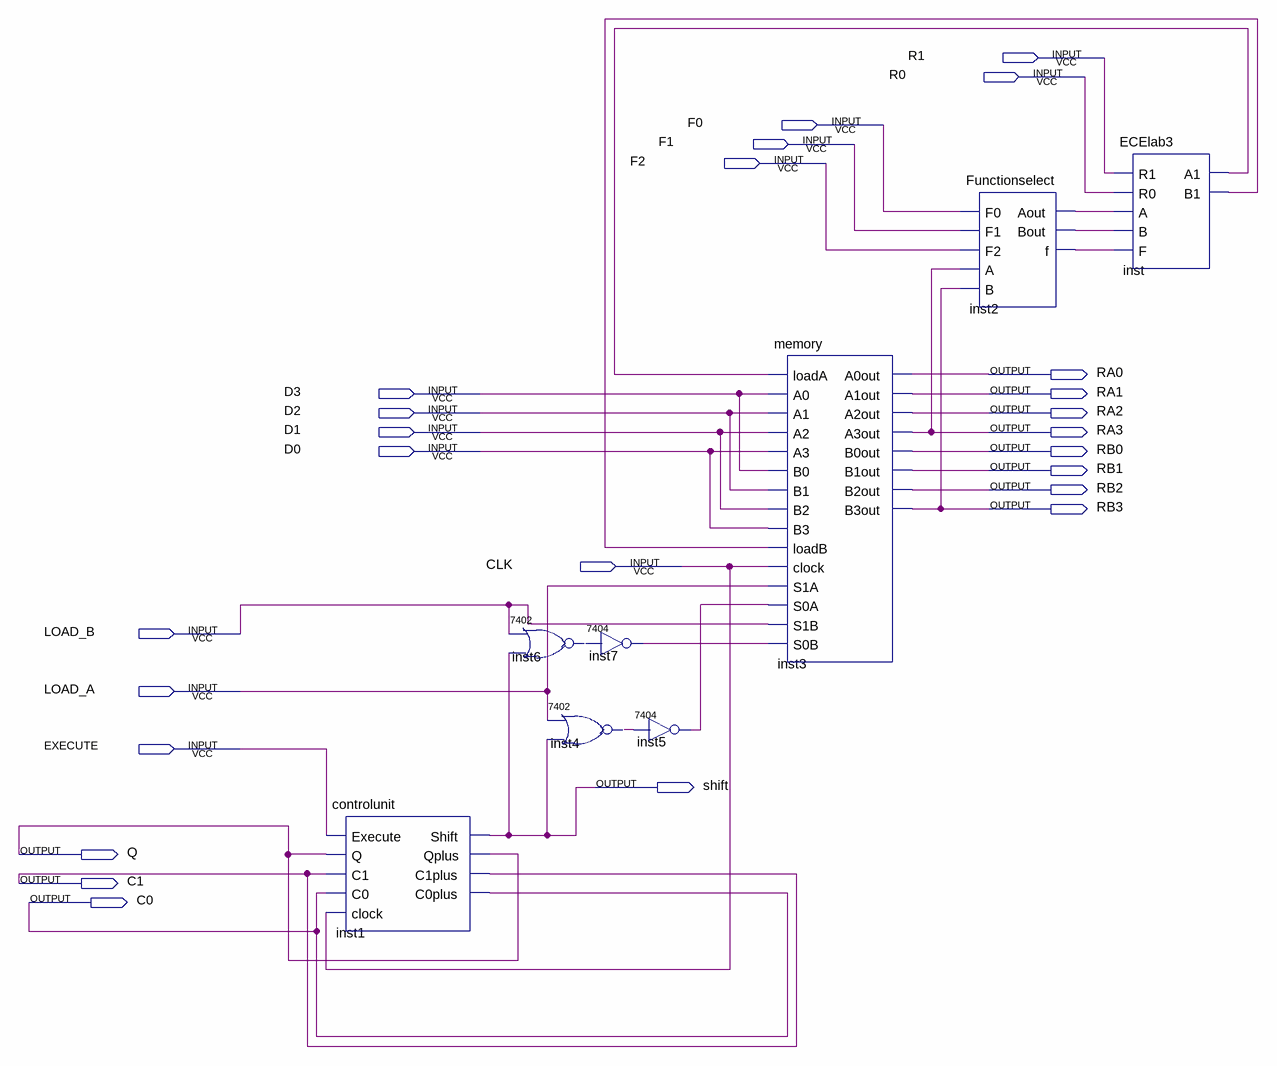
[diagram p0: schematic sheet]
// Quartus schematic lab3final.bdf as structural Verilog: 8 symbols, 25 pins
module lab3final (
  input  R1,
  input  R0,
  input  F0,
  input  F1,
  input  F2,
  input  D3,
  input  D2,
  input  D1,
  input  D0,
  input  CLK,
  input  LOAD_B,
  input  LOAD_A,
  input  EXECUTE,
  output RA0,
  output RA1,
  output RA2,
  output RA3,
  output RB0,
  output RB1,
  output RB2,
  output RB3,
  output shift,
  output Q,
  output C1,
  output C0
);

  wire inst2_aout, inst2_bout, inst2_f, inst4_1, inst5_1, inst6_1, inst7_1, inst_a1, inst_b1;

  controlunit inst1 (
    .Execute(EXECUTE), .Q(Q), .C1(C1), .C0(C0), .clock(CLK), .Shift(shift), .Qplus(Q), .C1plus(C1),
    .C0plus(C0));
  \7402  inst6 (.\2 (LOAD_B), .\3 (shift), .\1 (inst6_1));
  \7402  inst4 (.\2 (LOAD_A), .\3 (shift), .\1 (inst4_1));
  \7404  inst7 (.\2 (inst6_1), .\1 (inst7_1));
  \7404  inst5 (.\2 (inst4_1), .\1 (inst5_1));
  memory inst3 (
    .loadA(inst_a1), .A0(D3), .A1(D2), .A2(D1), .A3(D0), .B0(D3), .B1(D2), .B2(D1), .B3(D0), .loadB(inst_b1),
    .clock(CLK), .S1A(LOAD_A), .S0A(inst5_1), .S1B(LOAD_B), .S0B(inst7_1), .A0out(RA0), .A1out(RA1),
    .A2out(RA2), .A3out(RA3), .B0out(RB0), .B1out(RB1), .B2out(RB2), .B3out(RB3));
  Functionselect inst2 (.F0(F0), .F1(F1), .F2(F2), .A(RA3), .B(RB3), .Aout(inst2_aout), .Bout(inst2_bout), .f(inst2_f));
  ECElab3 inst (.R1(R1), .R0(R0), .A(inst2_aout), .B(inst2_bout), .F(inst2_f), .A1(inst_a1), .B1(inst_b1));
endmodule
